# EAGLE design ezlpc (EAGLE 6.5.0)
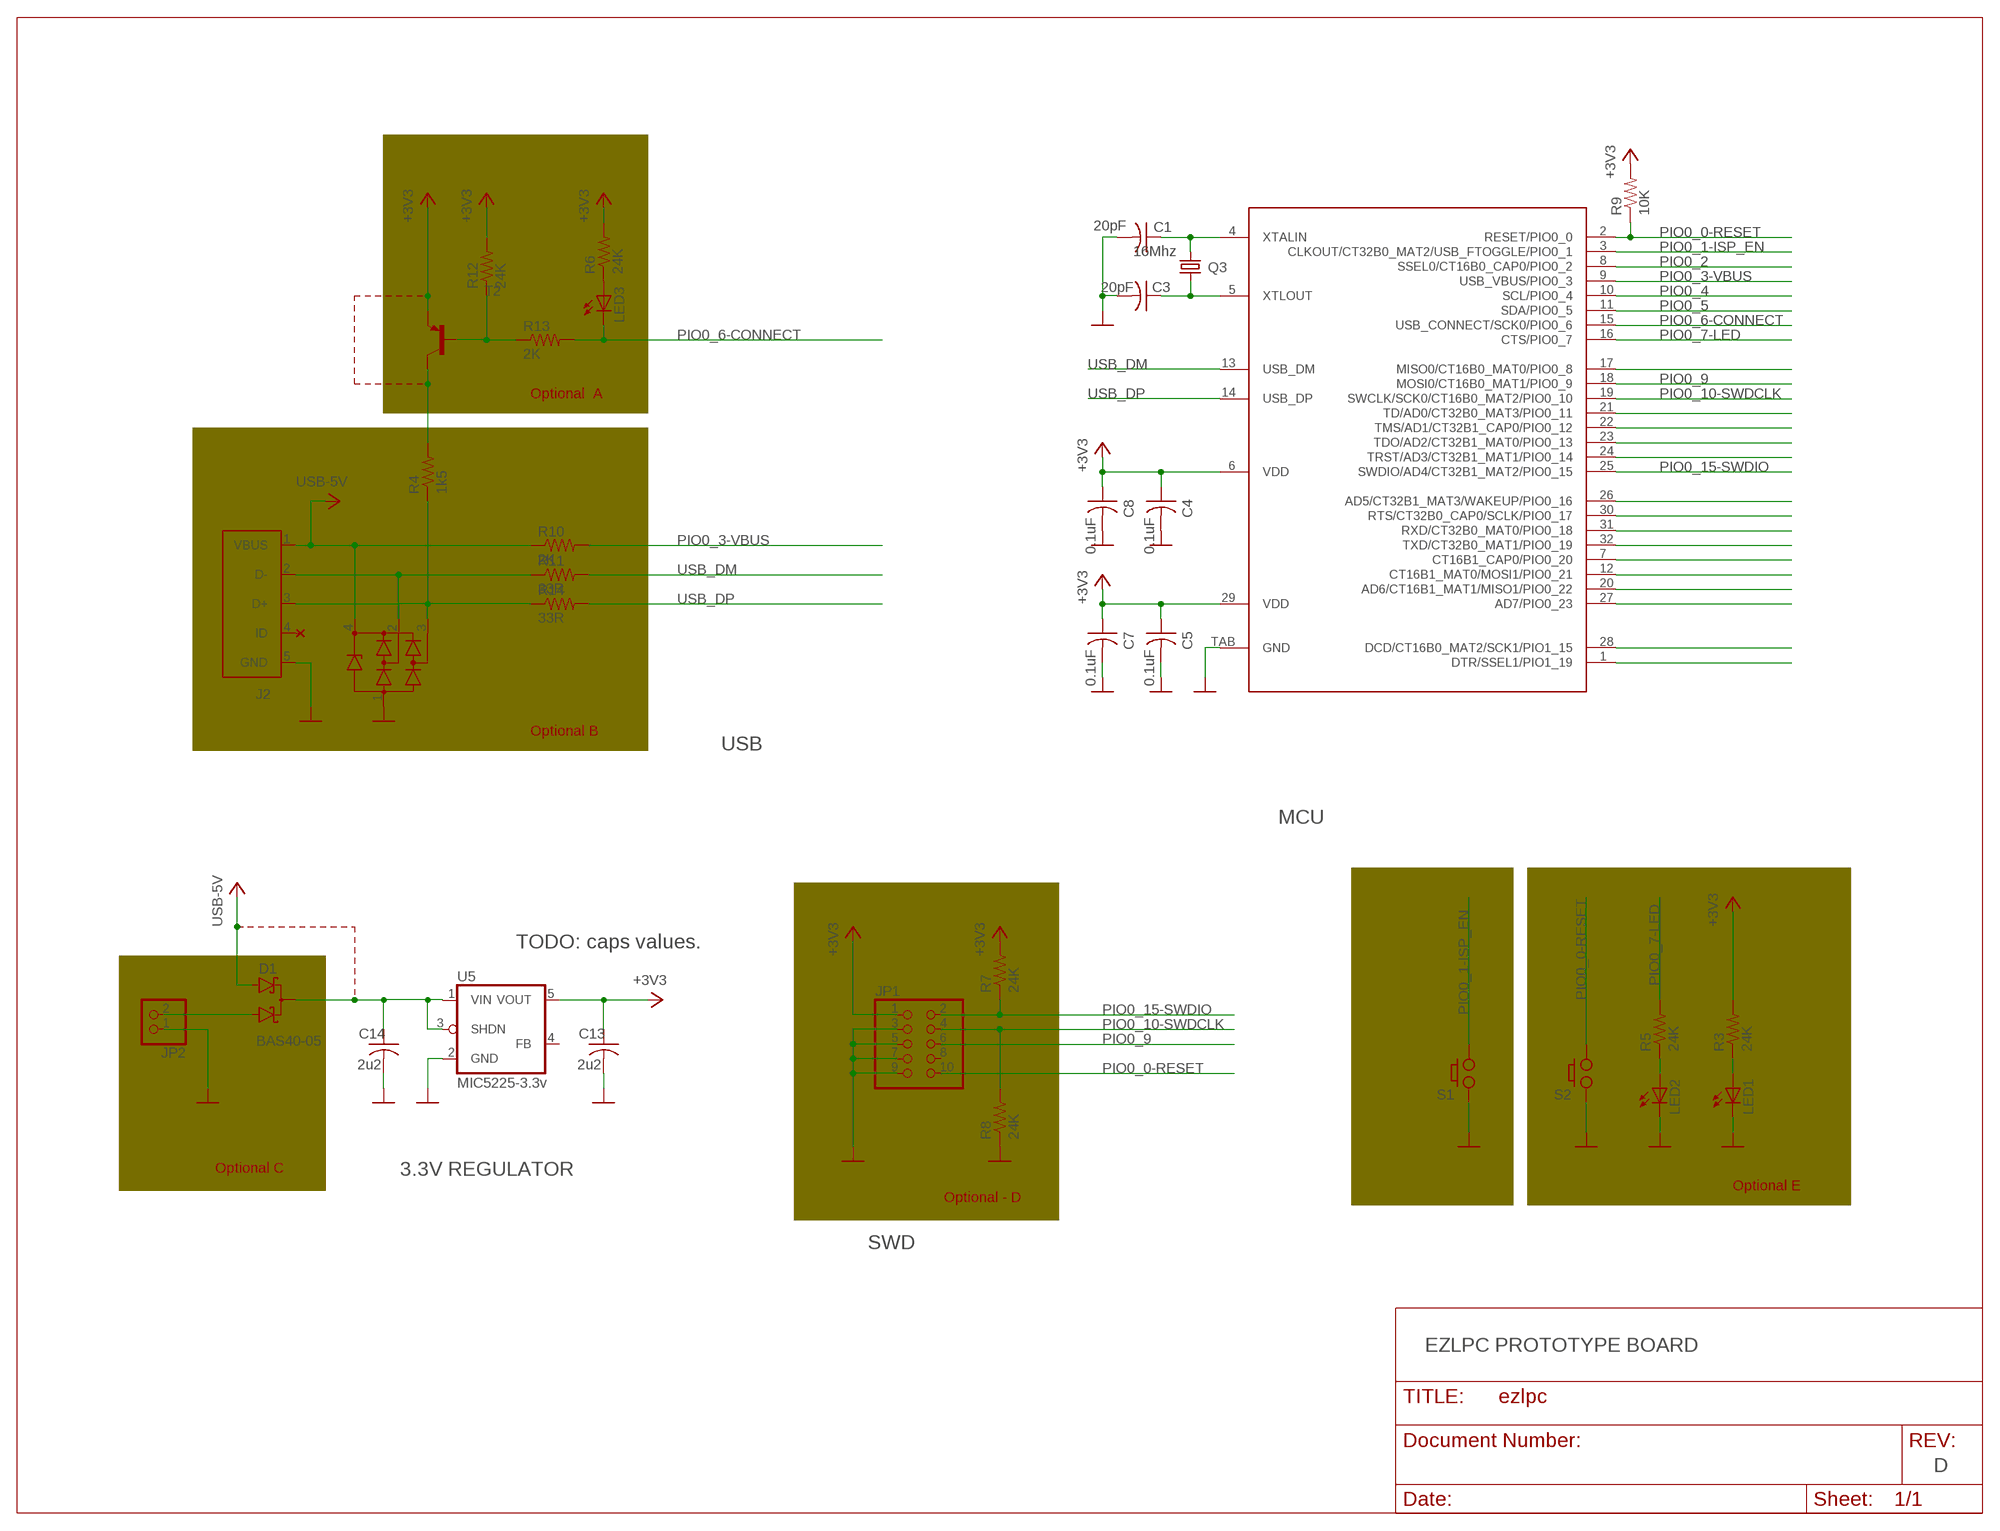
[diagram p0: schematic, sheet 1]

## Parts
C1  20pF  CAP-C0603  [C0603]
C3  20pF  CAP-C0603  [C0603]
C4  0.1uF  CAP-C0603  [C0603]
C5  0.1uF  CAP-C0603  [C0603]
C7  0.1uF  CAP-C0603  [C0603]
C8  0.1uF  CAP-C0603  [C0603]
C13  2u2  CAP-C0603  [C0603]
C14  2u2  CAP-C0603  [C0603]
D1  BAS40-05  [SOT23]
J2  USB  [USB-MICRO-ZX62RD-AB-5P8]
JP1  SWD-HEADER  [SWD-HEADER]
JP2  PINHD-1X2  [1X02]
LED1  LEDCHIP-LED0603  [CHIP-LED0603]
LED2  LEDCHIP-LED0603  [CHIP-LED0603]
LED3  LEDCHIP-LED0603  [CHIP-LED0603]
Q3  16Mhz  CRYSTALCTS406  [CRYSTAL-CTS406]
R3  24K  R-US_R0402  [R0402]
R4  1k5  R-US_R0402  [R0402]
R5  24K  R-US_R0402  [R0402]
R6  24K  R-US_R0402  [R0402]
R7  24K  R-US_R0402  [R0402]
R8  24K  R-US_R0402  [R0402]
R9  10K  R-US_R0402  [R0402]
R10  2K  R-US_R0402  [R0402]
R11  33R  R-US_R0402  [R0402]
R12  24K  R-US_R0402  [R0402]
R13  2K  R-US_R0402  [R0402]
R14  33R  R-US_R0402  [R0402]
S1  PUSH_BUTTON  [PUSH_BUTTON]
S2  PUSH_BUTTON  [PUSH_BUTTON]
T2  BC857B-PNP-SOT23-BEC  [SOT23-BEC]
U4  LPC11U35FHN33/501  [HVQFN33-5MM]
U5  MIC5225-3.3v  TC1015  [SOT25]
U$5  PRTR5VOU2X  [SOT143B]

## Nets
+3V3: C4.1 C5.1 C7.1 C8.1 C13.1 JP1.1 R3.2 R6.2 R7.2 R9.2 R12.2 T2.E U4.6(VDD) U4.29(VDD) U5.5(VOUT)
GND: C1.2 C3.2 C4.2 C5.2 C7.2 C8.2 C13.2 C14.2 J2.5(GND) JP1.3 JP1.5 JP1.7 JP1.9 JP2.1 LED1.C LED2.C R8.1 S1.A1 S2.A1 U4.TAB(GND) U5.2(GND) U$5.1(GND)
N$1: C1.1 Q3.1 U4.4(XTALIN)
N$2: LED1.A R3.1
N$3: C3.1 Q3.3 U4.5(XTLOUT)
N$4: R12.1 R13.1 T2.B
N$5: R4.2 T2.C
N$6: LED2.A R5.1
N$7: LED3.A R6.1
N$8: J2.2(D-) J2.3(D+) R4.1 R11.1 R14.1 U$5.2(IO1) U$5.3(IO2)
N$10: C14.1 D1.3(C) U5.1(VIN) U5.3(SHDN)
N$11: U4.17(MISO0/CT16B0_MAT0/PIO0_8)
N$13: D1.1(A1) JP2.2
N$14: U4.21(TD/AD0/CT32B0_MAT3/PIO0_11)
N$15: U4.22(TMS/AD1/CT32B1_CAP0/PIO0_12)
N$16: U4.23(TDO/AD2/CT32B1_MAT0/PIO0_13)
N$17: U4.24(TRST/AD3/CT32B1_MAT1/PIO0_14)
N$19: U4.26(AD5/CT32B1_MAT3/WAKEUP/PIO0_16)
N$20: U4.30(RTS/CT32B0_CAP0/SCLK/PIO0_17)
N$21: U4.31(RXD/CT32B0_MAT0/PIO0_18)
N$22: U4.32(TXD/CT32B0_MAT1/PIO0_19)
N$23: U4.7(CT16B1_CAP0/PIO0_20)
N$24: U4.12(CT16B1_MAT0/MOSI1/PIO0_21)
N$25: U4.20(AD6/CT16B1_MAT1/MISO1/PIO0_22)
N$26: U4.27(AD7/PIO0_23)
N$27: U4.28(DCD/CT16B0_MAT2/SCK1/PIO1_15)
N$28: U4.1(DTR/SSEL1/PIO1_19)
PIO0_0-RESET: JP1.10 R9.1 S2.B2 U4.2(RESET/PIO0_0)
PIO0_1-ISP_EN: S1.B2 U4.3(CLKOUT/CT32B0_MAT2/USB_FTOGGLE/PIO0_1)
PIO0_2: U4.8(SSEL0/CT16B0_CAP0/PIO0_2)
PIO0_3-VBUS: R10.2 U4.9(USB_VBUS/PIO0_3)
PIO0_4: U4.10(SCL/PIO0_4)
PIO0_5: U4.11(SDA/PIO0_5)
PIO0_6-CONNECT: LED3.C R13.2 U4.15(USB_CONNECT/SCK0/PIO0_6)
PIO0_7-LED: R5.2 U4.16(CTS/PIO0_7)
PIO0_9: JP1.6 U4.18(MOSI0/CT16B0_MAT1/PIO0_9)
PIO0_10-SWDCLK: JP1.4 R8.2 U4.19(SWCLK/SCK0/CT16B0_MAT2/PIO0_10)
PIO0_15-SWDIO: JP1.2 R7.1 U4.25(SWDIO/AD4/CT32B1_MAT2/PIO0_15)
USB-5V: D1.2(A2) J2.1(VBUS) R10.1 U$5.4(VCC)
USB_DM: R11.2 U4.13(USB_DM)
USB_DP: R14.2 U4.14(USB_DP)
Unconnected: J2.4(ID) JP1.8 U5.4(FB)

## Notes on the sheet
- Optional  A
- Optional B
- USB
- MCU
- TODO: caps values.
- Optional C | 3.3V REGULATOR
- Optional E
- Optional - D
- SWD
- EZLPC PROTOTYPE BOARD
- D

## Library data of the parts
C1 C3-C5 C7 C8 C13 C14 = pmon_3v8:CAP-: CAPACITOR, American symbol
D1 = ezlpc:BAS40-05: Silicon Schottky Diodes General-purpose diode for high-speed switching
J2 = ezlpc:USB
JP1 = ezlpc:SWD-HEADER: PIN HEADER
JP2 = pinhead:PINHD-1X2: PIN HEADER
LED1-LED3 = led:LED: LED OSRAM: - CHIPLED LG R971, LG N971, LY N971, LG Q971, LY Q971, LO R971, LY R971 LH N974, LH R974 LS Q976, LO Q976, LY Q976 LO Q996 - Hyper CHIPLED LW Q18S LB Q993, LB Q99A, LB R99A - SideLED LS A670, LO A670, LY A670, LG A670, LP A670 LB A673, LV A673, LT A673, LW A673 LH A674 LY A675 LS A676, LA A676, LO A676, LY A676, LW A676 LS A679, LY A679, LG A679 - Hyper Micro SIDELED® LS Y876, LA Y876, LO Y876, LY Y876 LT Y87S - SmartLED LW L88C, LW L88S LB L89C, LB L89S, LG L890 LS L89K, LO L89K, LY L89K LS L896, LA L896, LO L896, LY L896 - TOPLED LS T670, LO T670, LY T670, LG T670, LP T670 LSG T670, LSP T670, LSY T670, LOP T670, LYG T670 LG T671, LOG T671, LSG T671 LB T673, LV T673, LT T673, LW T673 LH T674 LS T676, LA T676, LO T676, LY T676, LB T676, LH T676, LSB T676, LW T676 LB T67C, LV T67C, LT T67C, LS T67K, LO T67K, LY T67K, LW E67C LS E67B, LA E67B, LO E67B, LY E67B, LB E67C, LV E67C, LT E67C LW T67C LS T679, LY T679, LG T679 LS T770, LO T770, LY T770, LG T770, LP T770 LB T773, LV T773, LT T773, LW T773 LH T774 LS E675, LA E675, LY E675, LS T675 LS T776, LA T776, LO T776, LY T776, LB T776 LHGB T686 LT T68C, LB T68C - Hyper Mini TOPLED® LB M676 - Mini TOPLED Santana® LG M470 LS M47K, LO M47K, LY M47K Source: http://www.osram.convergy.de LUXEON: - LUMILED® LXK2-PW12-R00, LXK2-PW12-S00, LXK2-PW14-U00, LXK2-PW14-V00 LXK2-PM12-R00, LXK2-PM12-S00, LXK2-PM14-U00 LXK2-PE12-Q00, LXK2-PE12-R00, LXK2-PE12-S00, LXK2-PE14-T00, LXK2-PE14-U00 LXK2-PB12-K00, LXK2-PB12-L00, LXK2-PB12-M00, LXK2-PB14-N00, LXK2-PB14-P00, LXK2-PB14-Q00 LXK2-PR12-L00, LXK2-PR12-M00, LXK2-PR14-Q00, LXK2-PR14-R00 LXK2-PD12-Q00, LXK2-PD12-R00, LXK2-PD12-S00 LXK2-PH12-R00, LXK2-PH12-S00 LXK2-PL12-P00, LXK2-PL12-Q00, LXK2-PL12-R00 Source: www.luxeon.com KINGBRIGHT: KA-3528ASYC Source: www.kingbright.com
Q3 = pmon_3v8:CRYSTAL: CRYSTAL; OC_FARNELL: unknown; OC_NEWARK: unknown
R3-R14 = rcl:R-US_: RESISTOR, American symbol
S1 S2 = ezlpc:PUSH_BUTTON: CKN10502CT-ND
T2 = ezlpc:*-PNP-: PNP Transistror
U4 = ezlpc:LPC11U35FHN33/501
U5 = pmon_3v8:TC1015: 150mA Low Noise LDO Voltage Regulator with Enable TSC [Taiwan Semiconductor Company, Ltd] Source: http://www.taiwansemi.com .. 5205_0409c.pdf
U$5 = ezlpc:PRTR5VOU2X

## Net classes
1 power: width 0.254 mm

## Board
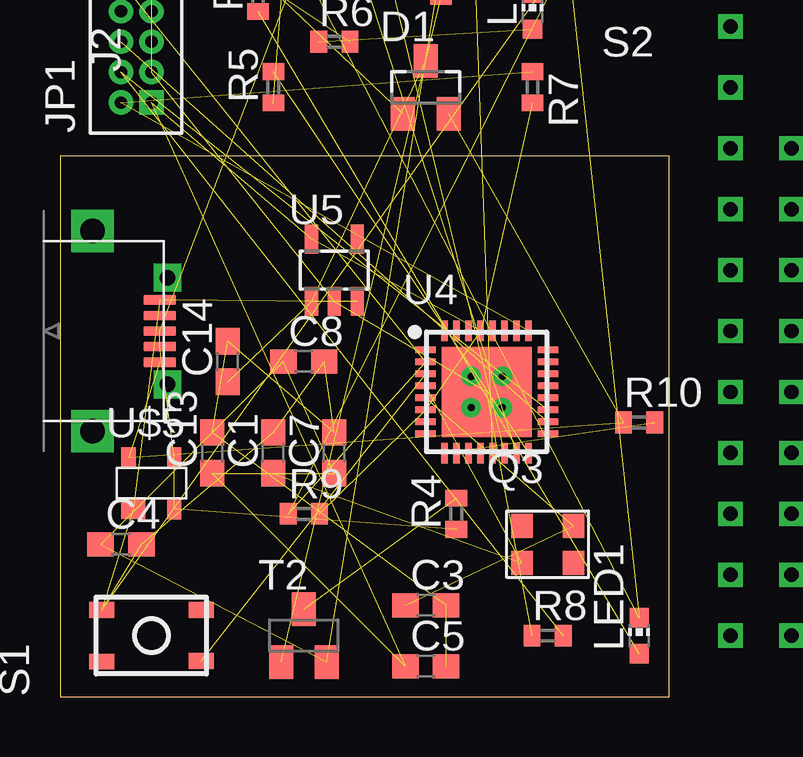
[diagram p1: board, top side]

Size 25.38 x 22.53 mm. Coordinates in mm from the lower left corner, seen from the top.
Outline: 0,0 25.38,0 25.38,22.53 0,22.53 0,0
Copper layers (1*16): Top 0.035mm / dielectric 1.5mm / Bottom 0.035mm
Design rules "default": minimum track width 10mil, minimum drill 24mil, track to track 8mil, track to pad 8mil, pad to pad 8mil, via to via 8mil, smd to smd 8mil, copper to edge 40mil, drill to drill 8mil, minimum pad ring 10mil, minimum via ring 8mil, stop-mask expansion 4mil, vias tented up to drill 0mil, thermal gap 10mil

### Footprints (pad centres in the part's own frame; a part is rotated, then mirrored left to right if it is on the bottom)
C0603 = smd 1.1 x 1: 1 -0.85,0; 2 0.85,0
SOT23 = smd 1 x 1.4: 1 -0.95,-1.1; 2 0.95,-1.1; 3 0,1.1
USB-MICRO-ZX62RD-AB-5P8 = smd 0.4 x 1.35: 1 1.3,5.425; 2 0.65,5.425; 3 0,5.425; 4 -0.65,5.425; 5 -1.3,5.425 | drill 1.016 pad 1.778 square: A -4.175,2.625; D 4.175,2.625 | drill 0.65 pad 0.914 square: B -2.225,5.75; C 2.225,5.75
SWD-HEADER = drill 0.508 square: 1 0,0 | drill 0.508: 2 0,1.27; 3 1.27,0; 4 1.27,1.27; 5 2.54,0; 6 2.54,1.27; 7 3.81,0; 8 3.81,1.27; 9 5.08,0; 10 5.08,1.27
1X02 = drill 1.016 long: 1 -1.27,0; 2 1.27,0
CHIP-LED0603 = smd 0.8 x 0.8: A 0,-0.75; C 0,0.75
CRYSTAL-CTS406 = smd 0.9 x 1: 1 -1.075,-0.775; 2 1.075,-0.775; 3 1.075,0.775; 4 -1.075,0.775
R0402 = smd 0.7 x 0.9: 1 -0.65,0; 2 0.65,0
PUSH_BUTTON = smd 1.05 x 0.65: A1 -2.075,1.075; A2 2.075,1.075; B1 -2.075,-1.075; B2 2.075,-1.05
SOT23-BEC = smd 1 x 1.4: B -0.95,-1.1; C 0,1.1; E 0.95,-1.1
HVQFN33-5MM = smd 0.85 x 0.27: 1 -2.55,1.75; 2 -2.55,1.25; 3 -2.55,0.75; 4 -2.55,0.25; 5 -2.55,-0.25; 6 -2.55,-0.75; 7 -2.55,-1.25; 8 -2.55,-1.75; 17 2.55,-1.75; 18 2.55,-1.25; 19 2.55,-0.75; 20 2.55,-0.25; 21 2.55,0.25; 22 2.55,0.75; 23 2.55,1.25; 24 2.55,1.75 | smd 0.27 x 0.85: 9 -1.75,-2.55; 10 -1.25,-2.55; 11 -0.75,-2.55; 12 -0.25,-2.55; 13 0.25,-2.55; 14 0.75,-2.55; 15 1.25,-2.55; 16 1.75,-2.55; 25 1.75,2.55; 26 1.25,2.55; 27 0.75,2.55; 28 0.25,2.55; 29 -0.25,2.55; 30 -0.75,2.55; 31 -1.25,2.55; 32 -1.75,2.55 | drill 0.3 pad 0.6: P$1 -0.65,0.65; P$2 0.65,0.65; P$3 0.65,-0.65; P$4 -0.65,-0.65 | smd 3.75 x 3.75: TAB 0,0
SOT25 = smd 0.55 x 1.2: 1 -0.95,-1.3; 2 0,-1.3; 3 0.95,-1.3; 4 0.95,1.3; 5 -0.95,1.3
SOT143B = smd 1 x 0.8: 1 -0.75,-1.075 | smd 0.6 x 0.85: 2 0.95,-1.075; 3 0.95,1.075; 4 -0.95,1.075

### Placement (x,y rotation side)
C1  8.89,10.16 90 top
C3  15.24,3.81 0 top
C4  2.54,6.35 0 top
C5  15.24,1.27 0 top
C7  11.43,10.16 90 top
C8  10.16,13.97 0 top
C13  6.35,10.16 90 top
C14  6.99,13.97 90 top
D1  15.24,25.4 0 top
J2  -1.27,15.24 270 top
JP1  3.81,24.77 90 top
JP2  2.54,34.29 0 top  (outside the outline)
LED1  24.13,2.54 0 top
LED2  8.89,34.29 90 top  (outside the outline)
LED3  19.68,28.57 0 top  (outside the outline)
Q3  20.32,6.35 0 top
R3  8.26,29.21 90 top  (outside the outline)
R4  16.51,7.62 90 top
R5  8.89,25.4 90 top
R6  11.43,27.3 0 top  (outside the outline)
R7  19.68,25.4 270 top
R8  20.32,2.54 0 top
R9  10.16,7.62 0 top
R10  24.13,11.43 0 top
R11  16.51,34.29 0 top  (outside the outline)
R12  15.88,29.84 90 top  (outside the outline)
R13  12.06,29.84 0 top  (outside the outline)
R14  12.06,34.29 0 top  (outside the outline)
S1  3.81,2.54 0 top
S2  22.23,33.02 90 top  (outside the outline)
T2  10.16,2.54 0 top
U4  17.78,12.7 0 top
U5  11.43,17.78 0 top
U$5  3.81,8.89 0 top

### Tracks (layer width: path | path; a pad name or v marks a point on that pad's centre or on a via)
+3V3  (14 unrouted)
GND  (21 unrouted)
N$1  (2 unrouted)
N$2  (1 unrouted)
N$3  (2 unrouted)
N$4  (2 unrouted)
N$5  (1 unrouted)
N$6  (1 unrouted)
N$7  (1 unrouted)
N$8  (6 unrouted)
N$10  (3 unrouted)
N$12  (via drill 0.6)
  other vias: 27.94,2.54
N$13  (1 unrouted)
N$18  (via drill 0.6)
  other vias: 27.94,5.08
N$29  (via drill 0.6)
  other vias: 27.94,7.62
N$30  (via drill 0.6)
  other vias: 27.94,10.16
N$31  (via drill 0.6)
  other vias: 27.94,12.7
N$32  (via drill 0.6)
  other vias: 27.94,15.24
N$33  (via drill 0.6)
  other vias: 27.94,17.78
N$34  (via drill 0.6)
  other vias: 27.94,20.32
N$35  (via drill 0.6)
  other vias: 27.94,22.86
N$36  (via drill 0.6)
  other vias: 27.94,25.4
N$37  (via drill 0.6)
  other vias: 27.94,27.94
N$38  (via drill 0.6)
  other vias: 27.94,30.48
N$39  (via drill 0.6)
  other vias: 27.94,33.02
N$40  (via drill 0.6)
  other vias: 27.94,35.56
N$41  (via drill 0.6)
  other vias: 27.94,38.1
N$42  (via drill 0.6)
  other vias: 27.94,40.64
N$43  (via drill 0.6)
  other vias: 30.48,2.54
N$44  (via drill 0.6)
  other vias: 30.48,5.08
N$45  (via drill 0.6)
  other vias: 30.48,7.62
N$46  (via drill 0.6)
  other vias: 30.48,10.16
N$47  (via drill 0.6)
  other vias: 30.48,12.7
N$48  (via drill 0.6)
  other vias: 30.48,15.24
N$49  (via drill 0.6)
  other vias: 30.48,17.78
N$50  (via drill 0.6)
  other vias: 30.48,20.32
N$51  (via drill 0.6)
  other vias: 30.48,22.86
PIO0_0-RESET  (3 unrouted)
PIO0_1-ISP_EN  (1 unrouted)
PIO0_3-VBUS  (1 unrouted)
PIO0_6-CONNECT  (2 unrouted)
PIO0_7-LED  (1 unrouted)
PIO0_9  (1 unrouted)
PIO0_10-SWDCLK  (2 unrouted)
PIO0_15-SWDIO  (2 unrouted)
USB-5V  (3 unrouted)
USB_DM  (1 unrouted)
USB_DP  (1 unrouted)